# Altium project bhumishboard.PrjPcb (part 2 of 2)

## Sheet SPI.SchDoc
size A3
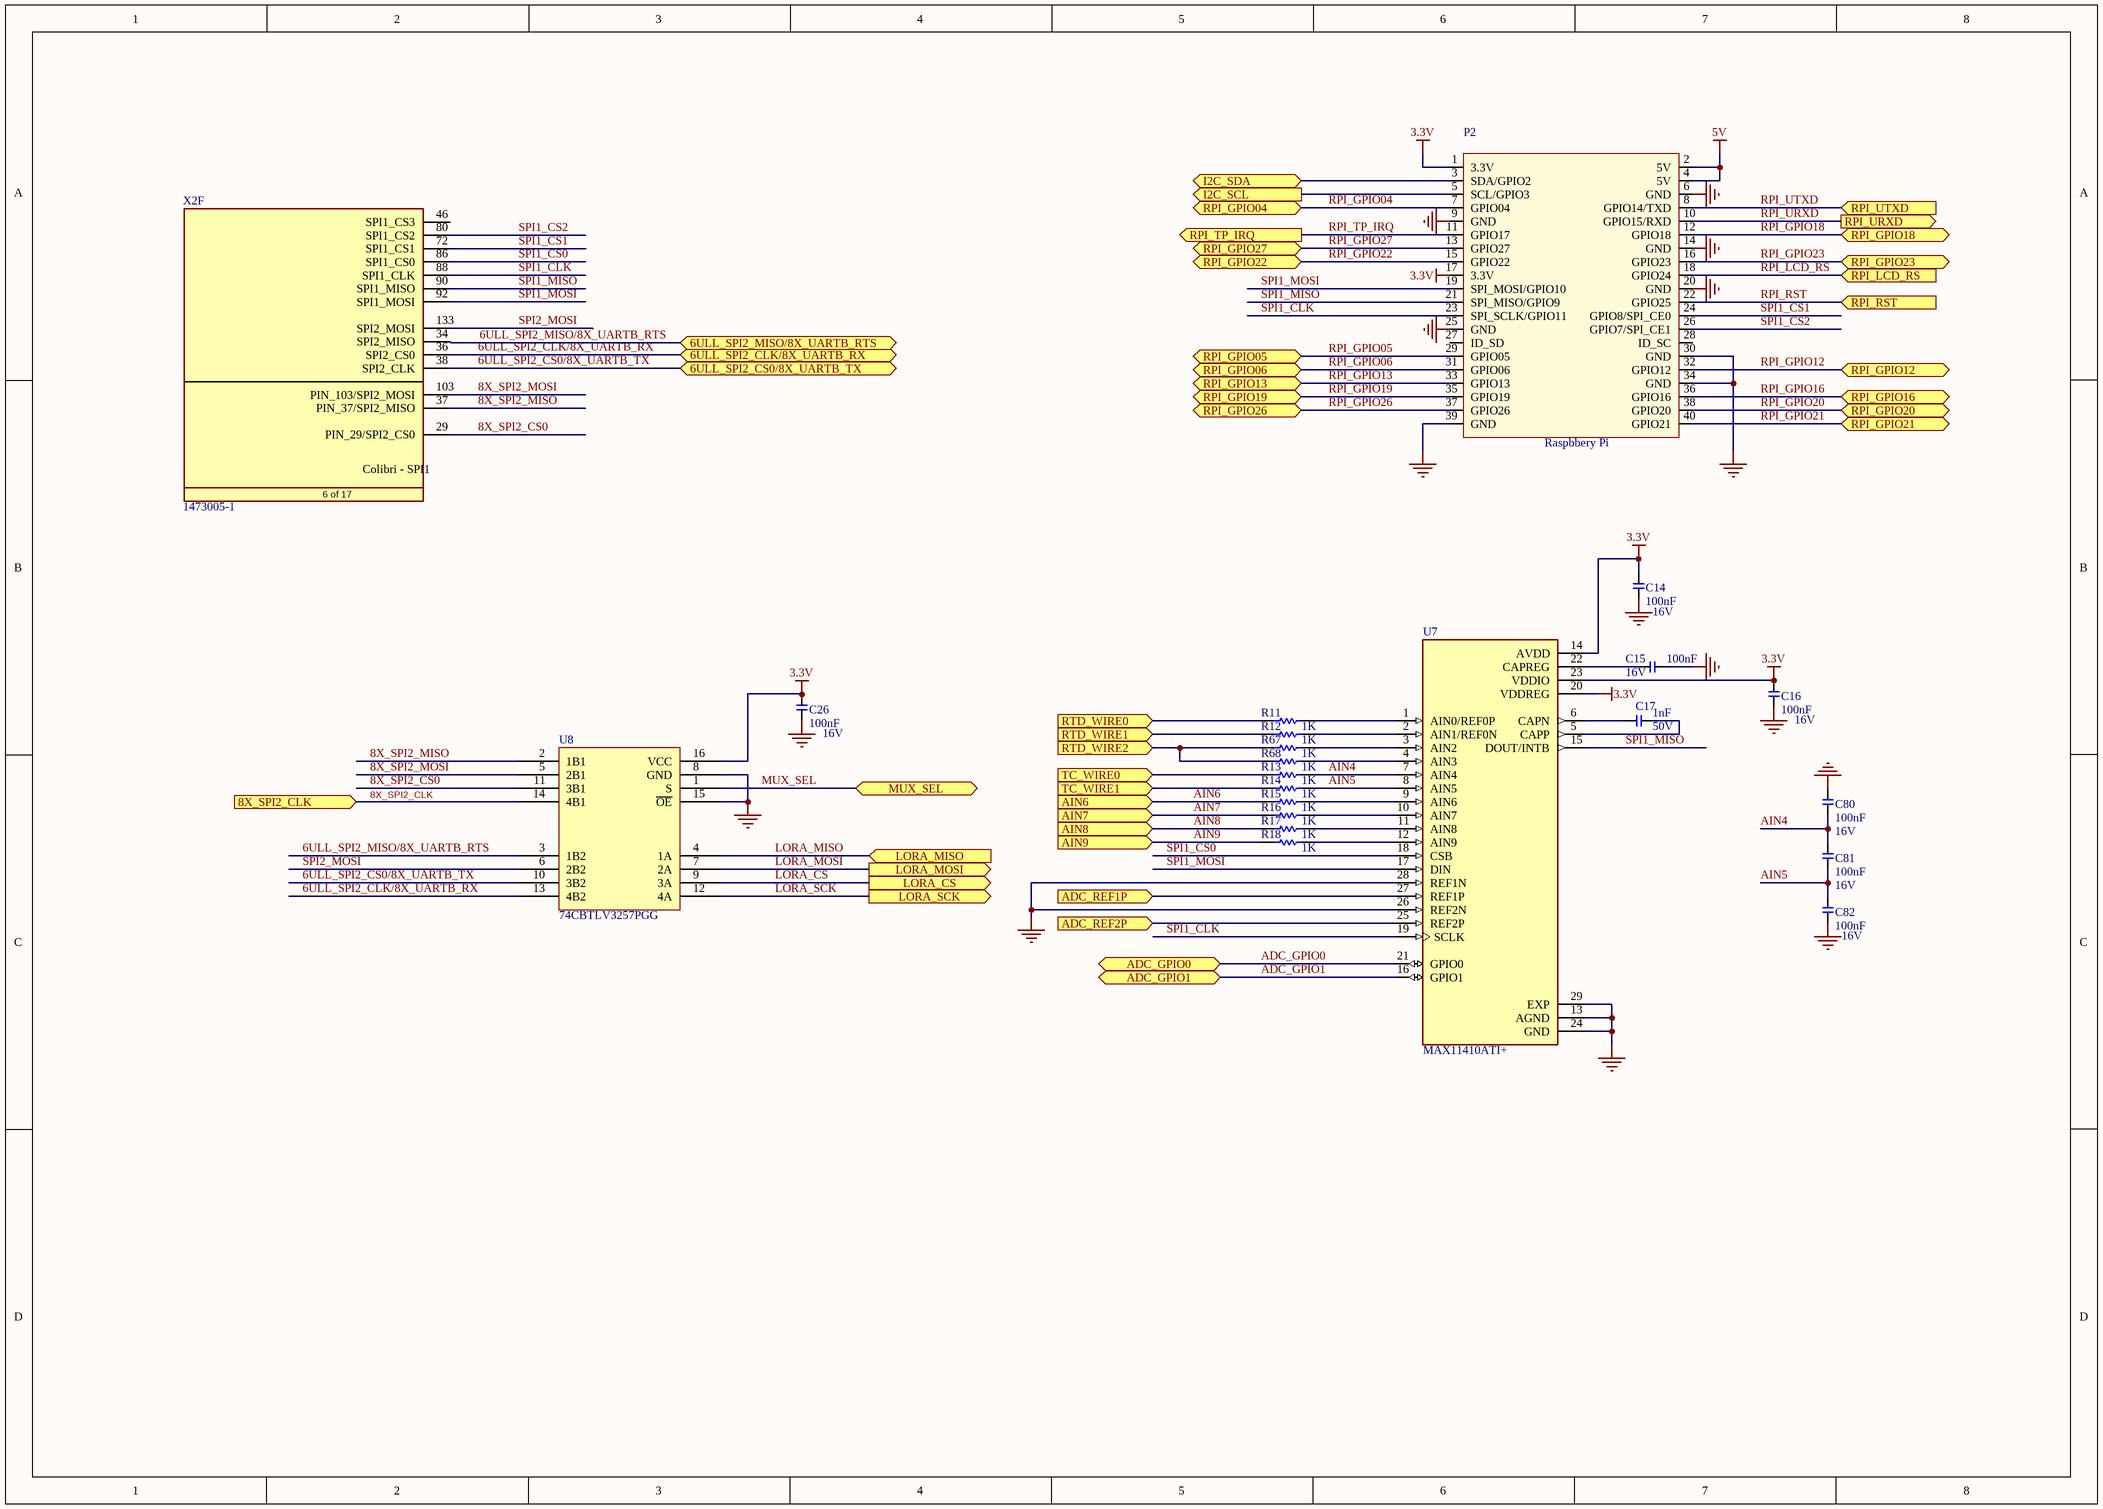
[diagram p10: SPI.SchDoc]

### Parts
C14  Rating: 16V  [T_CAPC0603X33N]  (hidden comment: 100nF)
C15  Rating: 16V  [T_CAPC0603X33N]  (hidden comment: 100nF)
C16  Rating: 16V  [T_CAPC0603X33N]  (hidden comment: 100nF)
C17  Rating: 50V  [CAPC1005X60N]  (hidden comment: 1nF)
C26  Rating: 16V  [T_CAPC0603X33N]  (hidden comment: 100nF)
C80  Rating: 16V  [T_CAPC0603X33N]  (hidden comment: 100nF)
C81  Rating: 16V  [T_CAPC0603X33N]  (hidden comment: 100nF)
C82  Rating: 16V  [T_CAPC0603X33N]  (hidden comment: 100nF)
P2  Raspbbery Pi  [RASPI_GPIO_B+]
R11  1K  [RESC1608X50N]
R12  1K  [RESC1608X50N]
R13  1K  [RESC1608X50N]
R14  1K  [RESC1608X50N]
R15  1K  [RESC1608X50N]
R16  1K  [RESC1608X50N]
R17  1K  [RESC1608X50N]
R18  1K  [RESC1608X50N]
R67  1K  [RESC1608X50N]
R68  1K  [RESC1608X50N]
U7  MAX11410ATI+  [QFN40P400X400X80-29N]
U8  74CBTLV3257PGG  [SOP65P640X120-16N]
X2  1473005-1  [T_Tyco_1473005-1]  (part F of 17)

### Ports
6ULL_SPI2_CLK/8X_UARTB_RX (bidir), 6ULL_SPI2_CS0/8X_UARTB_TX (bidir), 6ULL_SPI2_MISO/8X_UARTB_RTS (bidir), 8X_SPI2_CLK (in), ADC_GPIO0 (bidir), ADC_GPIO1 (bidir), ADC_REF1P (in), ADC_REF2P (in), AIN6 (in), AIN7 (in), AIN8 (in), AIN9 (in), I2C_SCL (out), I2C_SDA (bidir), LORA_CS (out), LORA_MISO (in), LORA_MOSI (out), LORA_SCK (out), MUX_SEL (bidir), RPI_GPIO04 (bidir), RPI_GPIO05 (bidir), RPI_GPIO06 (bidir), RPI_GPIO12 (bidir), RPI_GPIO13 (bidir), RPI_GPIO16 (bidir), RPI_GPIO18 (bidir), RPI_GPIO19 (bidir), RPI_GPIO20 (bidir), RPI_GPIO21 (bidir), RPI_GPIO22 (bidir), RPI_GPIO23 (bidir), RPI_GPIO26 (bidir), RPI_GPIO27 (bidir), RPI_LCD_RS (in), RPI_RST (in), RPI_TP_IRQ (out), RPI_URXD (out), RPI_UTXD (in), RTD_WIRE0 (in), RTD_WIRE1 (in), RTD_WIRE2 (in), TC_WIRE0 (in), TC_WIRE1 (in)

### Nets
3.3V: C14.2 C16.2 C26.2 P2.1(3.3V) P2.17(3.3V) U7.14(AVDD) U7.20(VDDREG) U7.23(VDDIO) U8.16(VCC)
5V: P2.2(5V) P2.4(5V)
GND: C14.1 C15.1 C16.1 C26.1 C80.2 C82.1 P2.6(GND) P2.9(GND) P2.14(GND) P2.20(GND) P2.25(GND) P2.30(GND) P2.34(GND) P2.39(GND) U7.13(AGND) U7.24(GND) U7.26(REF2N) U7.28(REF1N) U7.29(EXP) U8.8(GND) U8.15(~{OE})
6ULL_SPI2_CLK/8X_UARTB_RX: U8.13(4B2) X2.36(SPI2_CS0) ; port 6ULL_SPI2_CLK/8X_UARTB_RX
6ULL_SPI2_CS0/8X_UARTB_TX: U8.10(3B2) X2.38(SPI2_CLK) ; port 6ULL_SPI2_CS0/8X_UARTB_TX
6ULL_SPI2_MISO/8X_UARTB_RTS: U8.3(1B2) X2.34(SPI2_MISO) ; port 6ULL_SPI2_MISO/8X_UARTB_RTS
8X_SPI2_CLK: U8.14(4B1) ; port 8X_SPI2_CLK
8X_SPI2_CS0: U8.11(3B1) X2.29(PIN_29/SPI2_CS0)
8X_SPI2_MISO: U8.2(1B1) X2.37(PIN_37/SPI2_MISO)
8X_SPI2_MOSI: U8.5(2B1) X2.103(PIN_103/SPI2_MOSI)
ADC_GPIO0: U7.21(GPIO0) ; port ADC_GPIO0
ADC_GPIO1: U7.16(GPIO1) ; port ADC_GPIO1
ADC_REF1P: U7.27(REF1P) ; port ADC_REF1P
AIN4: C80.1 C81.2 R13.2 U7.7(AIN4)
AIN5: C81.1 C82.2 R14.2 U7.8(AIN5)
AIN6: R15.1 ; port AIN6
AIN7: R16.1 ; port AIN7
AIN8: R17.1 ; port AIN8
AIN9: R18.1 U7.25(REF2P) ; port AIN9, port ADC_REF2P
I2C_SCL: P2.5(SCL/GPIO3) ; port I2C_SCL
I2C_SDA: P2.3(SDA/GPIO2) ; port I2C_SDA
LORA_CS: U8.9(3A) ; port LORA_CS
LORA_MISO: U8.4(1A) ; port LORA_MISO
LORA_MOSI: U8.7(2A) ; port LORA_MOSI
LORA_SCK: U8.12(4A) ; port LORA_SCK
MUX_SEL: U8.1(S) ; port MUX_SEL
RPI_GPIO04: P2.7(GPIO04) ; port RPI_GPIO04
RPI_GPIO05: P2.29(GPIO05) ; port RPI_GPIO05
RPI_GPIO06: P2.31(GPIO06) ; port RPI_GPIO06
RPI_GPIO12: P2.32(GPIO12) ; port RPI_GPIO12
RPI_GPIO13: P2.33(GPIO13) ; port RPI_GPIO13
RPI_GPIO16: P2.36(GPIO16) ; port RPI_GPIO16
RPI_GPIO18: P2.12(GPIO18) ; port RPI_GPIO18
RPI_GPIO19: P2.35(GPIO19) ; port RPI_GPIO19
RPI_GPIO20: P2.38(GPIO20) ; port RPI_GPIO20
RPI_GPIO21: P2.40(GPIO21) ; port RPI_GPIO21
RPI_GPIO22: P2.15(GPIO22) ; port RPI_GPIO22
RPI_GPIO23: P2.16(GPIO23) ; port RPI_GPIO23
RPI_GPIO26: P2.37(GPIO26) ; port RPI_GPIO26
RPI_GPIO27: P2.13(GPIO27) ; port RPI_GPIO27
RPI_LCD_RS: P2.18(GPIO24) ; port RPI_LCD_RS
RPI_RST: P2.22(GPIO25) ; port RPI_RST
RPI_TP_IRQ: P2.11(GPIO17) ; port RPI_TP_IRQ
RPI_URXD: P2.10(GPIO15/RXD) ; port RPI_URXD
RPI_UTXD: P2.8(GPIO14/TXD) ; port RPI_UTXD
RTD_WIRE0: R11.1 ; port RTD_WIRE0
RTD_WIRE1: R12.1 ; port RTD_WIRE1
RTD_WIRE2: R67.1 R68.1 ; port RTD_WIRE2
SPI1_CLK: P2.23(SPI_SCLK/GPIO11) U7.19(SCLK) X2.88(SPI1_CLK)
SPI1_CS0: U7.18(CSB) X2.86(SPI1_CS0)
SPI1_CS1: P2.24(GPIO8/SPI_CE0) X2.72(SPI1_CS1)
SPI1_CS2: P2.26(GPIO7/SPI_CE1) X2.80(SPI1_CS2)
SPI1_MISO: P2.21(SPI_MISO/GPIO9) U7.15(DOUT/INTB) X2.90(SPI1_MISO)
SPI1_MOSI: P2.19(SPI_MOSI/GPIO10) U7.17(DIN) X2.92(SPI1_MOSI)
SPI2_MOSI: U8.6(2B2) X2.133(SPI2_MOSI)
TC_WIRE0: R13.1 ; port TC_WIRE0
TC_WIRE1: R14.1 ; port TC_WIRE1
NetC15_2: C15.2 U7.22(CAPREG)
NetC17_1: C17.1 U7.5(CAPP)
NetC17_2: C17.2 U7.6(CAPN)
NetR11_2: R11.2 U7.1(AIN0/REF0P)
NetR12_2: R12.2 U7.2(AIN1/REF0N)
NetR15_2: R15.2 U7.9(AIN6)
NetR16_2: R16.2 U7.10(AIN7)
NetR17_2: R17.2 U7.11(AIN8)
NetR18_2: R18.2 U7.12(AIN9)
NetR67_2: R67.2 U7.3(AIN2)
NetR68_2: R68.2 U7.4(AIN3)

Not connected (* = marked no-connect by the designer): P2 27(ID_SD) 28(ID_SC); X2 46(SPI1_CS3)

### Notes on the sheet
- (in symbol CON-Tyco-1473005-1-200-0.6mm, part F) Colibri - SPI1; 6 of 17

### Library data of the parts
C14-C16 C26 C80-C82 = C-X7R-100nF-16V-10%-0603: Capacitor Ceramic X7R 100nF 16V 10% 0603; Tolerance: 10%; Type: X7R; Value: 100nF
C17 = C-X7R-1nF-50V-10%-0402: Capacitor Ceramic X7R 1nF 50V 10% 0402; Tolerance: 10%; Type: X7R; Value: 1nF
P2 = RASPI_GPIO_B+_PIN
R11-R18 R67 R68 = Res1: Resistor; mpn: CRCW060310K0FKEAHP; E14: 1738918; LatestRevisionDate: 17-Jul-2002; LatestRevisionNote: Re-released for DXP Platform.; PackageReference: AXIAL-0.3; PackageDescription: Axial Device, Thru-Hole; 2 Leads; 0.3 in Pin Spacing; Value: 1K
U7 = MAX11410ATI+: 24 Bit Analog to Digital Converter 5, 10 Input 1 Sigma-Delta 28-TQFN _4x4_; MF: Maxim Integrated; Package: TQFN-28 Maxim; MP: MAX11410ATI+; Price: None; Availability: Unavailable; Value: *; SnapEDA_Link: https://www.snapeda.com/parts/MAX11410ATI+/Maxim%20Integrated/view-part/1232119/?ref=snap
X2 = CON-Tyco-1473005-1-200-0.6mm: as X2 on sheet Colibri; Manufacturer Part No.: 1473005-1

## Sheet USB.SchDoc: Iris
size A3; Organization: Toradex AG; Address1: Altsagenstrasse 5; Address2: Horw; Address3: 6048; Address4: Switzerland; DocumentNumber: 6; Revision: V2.0; SheetNumber: 6; SheetTotal: 16
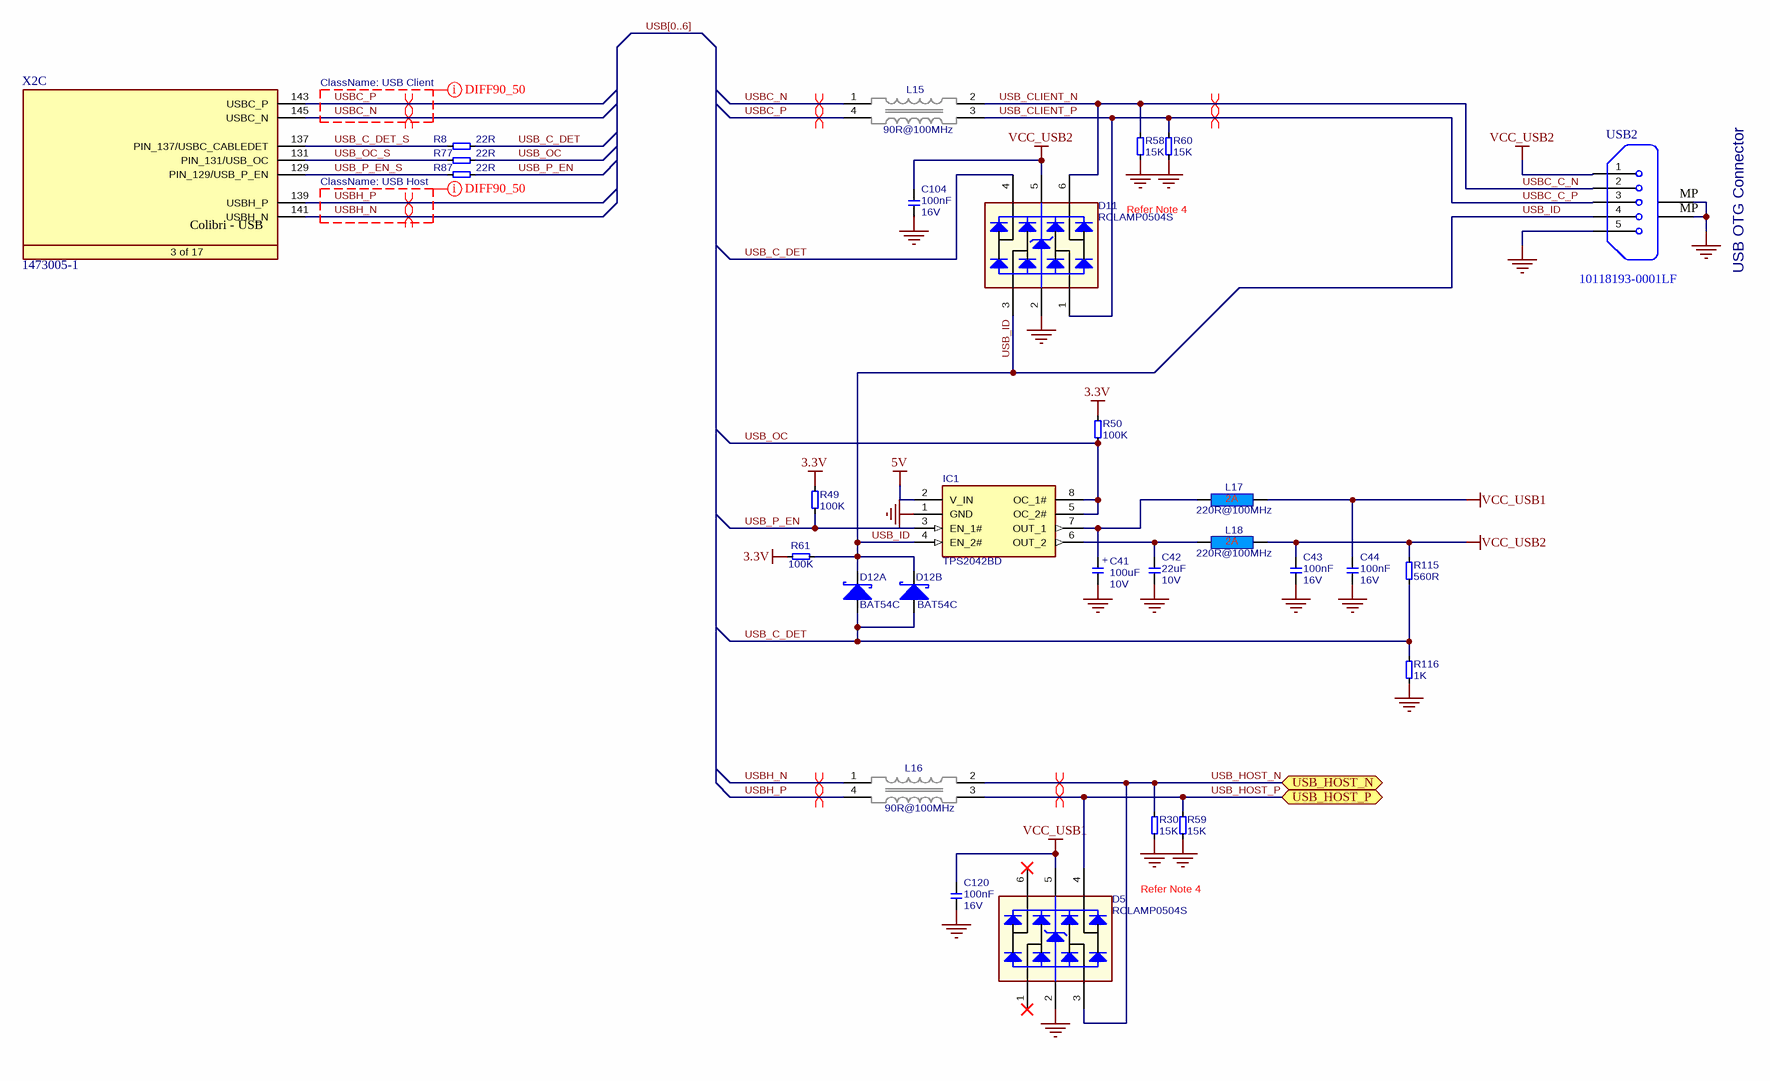
[diagram p11: USB.SchDoc]

### Parts
C41  Rating: 10V  [CAPMP3528X210N]  (hidden comment: 100uF)
C42  Rating: 10V  [T_CAPC0805X125N]  (hidden comment: 22uF)
C43  Rating: 16V  [CAPC1005X60N]  (hidden comment: 100nF)
C44  Rating: 16V  [CAPC1005X60N]  (hidden comment: 100nF)
C104  Rating: 16V  [CAPC1005X60N]  (hidden comment: 100nF)
C120  Rating: 16V  [CAPC1005X60N]  (hidden comment: 100nF)
D5  RCLAMP0504S  [T_SOT95P285X90-6N]
D11  RCLAMP0504S  [T_SOT95P285X90-6N]
D12  BAT54C  [SOT95P230X110-3N]  (parts A,B of 2)
IC1  TPS2042BD  [SOIC127P600X173-8N]
L15  90R@100MHz  [T_Murata_DLW21SN900SQ2]
L16  90R@100MHz  [T_Murata_DLW21SN900SQ2]
L17  220R@100MHz  [INDC1608X95N]
L18  220R@100MHz  [INDC1608X95N]
R8  22R  [RESC1005X40N]
R30  15K  [T_RESC0603X30N]
R49  100K  [RESC1005X40N]
R50  100K  [RESC1005X40N]
R58  15K  [T_RESC0603X30N]
R59  15K  [T_RESC0603X30N]
R60  15K  [T_RESC0603X30N]
R61  100K  [RESC1005X40N]
R77  22R  [RESC1005X40N]
R87  22R  [RESC1005X40N]
R115  560R  [RESC1005X40N]
R116  1K  [RESC1005X40N]
USB2  10118193-0001LF  [10118193-0001LF]
X2  1473005-1  [T_Tyco_1473005-1]  (part C of 17)

### Ports
USB_HOST_N (bidir), USB_HOST_P (bidir)

### Nets
3.3V: R49.2 R50.2 R61.2
5V: IC1.2(V_IN)
GND: C41.2 C42.1 C43.1 C44.1 C104.1 C120.1 D5.2 D11.2 IC1.1(GND) R30.1 R58.1 R59.1 R60.1 R116.2 USB2.5 USB2.6
VCC_USB1: C44.2 C120.2 D5.5 L17.2
VCC_USB2: C43.2 C104.2 D11.5 L18.2 R115.1 USB2.1
USB_C_DET: D11.4 D12.1 D12.2 R8.2 R115.2 R116.1
USB_C_DET_S: R8.1 X2.137(PIN_137/USBC_CABLEDET)
USB_CLIENT_N: D11.6 L15.2 R58.2 USB2.2  [also labelled USBC_C_N]
USB_CLIENT_P: D11.1 L15.3 R60.2 USB2.3  [also labelled USBC_C_P]
USB_HOST_N: D5.3 L16.2 R30.2 ; port USB_HOST_N
USB_HOST_P: D5.4 L16.3 R59.2 ; port USB_HOST_P
USB_ID: D11.3 D12.3 IC1.4(EN_2#) R61.1 USB2.4
USB_OC: IC1.5(OC_2#) IC1.8(OC_1#) R50.1 R77.2
USB_OC_S: R77.1 X2.131(PIN_131/USB_OC)
USB_P_EN: IC1.3(EN_1#) R49.1 R87.2
USB_P_EN_S: R87.1 X2.129(PIN_129/USB_P_EN)
USBC_N: L15.1 X2.145(USBC_N)
USBC_P: L15.4 X2.143(USBC_P)
USBH_N: L16.1 X2.141(USBH_N)
USBH_P: L16.4 X2.139(USBH_P)
NetC41_1: C41.1 IC1.7(OUT_1) L17.1
NetC42_2: C42.2 IC1.6(OUT_2) L18.1

Not connected (* = marked no-connect by the designer): D5 1* 6*

### Buses and harness runs
bus USB[0..6]

### Layout directives
differential pair: USB_CLIENT_N, USB_CLIENT_P, USB_HOST_N, USB_HOST_P, USBC_N, USBC_P, USBH_N, USBH_P
net class USB Client: USBC_N, USBC_P
net class USB Host: USBH_N, USBH_P

### Notes on the sheet
- Refer Note 4
- USB OTG Connector
- Title
- Size:
- Date:
- A3
- Number:
- Time:
- Revision:
- Sheet
- of
- File:
- (in symbol C-TA-100uF-10V-20%-3528) +
- (in symbol CON-Tyco-1473005-1-200-0.6mm, part C) Colibri - USB; 3 of 17
- (in symbol USB Micro-B) MP

### Library data of the parts
C41 = C-TA-100uF-10V-20%-3528: Capacitor TA 100uF 10V 20% 3528; Tolerance: 20%; Type: TA; Value: 100uF
C42 = C-X5R-22uF-10V-20%-0805: Capacitor Ceramic X5R 22uF 10V 20% 0805; Tolerance: 20%; Type: X5R; Value: 22uF
C43 C44 C104 C120 = C-X7R-100nF-16V-10%-0402: Capacitor Ceramic X7R 100nF 16V 10% 0402; Tolerance: 10%; Type: X7R; Value: 100nF
D5 D11 = D-Semtech-RClamp0504S: TVS Array low cap; Manufacturer Name: Semtech; Manufacturer Part No.: RCLAMP0504S
D12 = D-Philips-BAT54C-Schottky: BAT54C Schottky Diode; Manufacturer Name: Philips; Manufacturer Part No.: BAT54C
IC1 = IC-TI-TPS2042BD: Dual High Side Switch With OC_DET 500mA/CH; Manufacturer Name: Texas Instruments; Manufacturer Part No.: TPS2042BD
L15 L16 = L-Murata-DLW21SN900SQ2-90R@100MHz-330mA-25%: Common Mode Choke High Speed 90R 330mA; Manufacturer Name: Murata; Tolerance: 25%; Rating: 330mA; Manufacturer Part No.: DLW21SN900SQ2; Value: 90R@100MHz
L17 L18 = L-220R@100MHz-2A-25%-0603: 220R@100MHz 2A EMI FILTER; Tolerance: 25%; Rating: 2A; Value: 220R@100MHz
R8 R77 R87 = R-22R-63mW-5%-0402: Resistor 22 ohm 63mW 5% 0402; Rating: 63mW; Tolerance: 5%; Value: 22R
R30 R58-R60 = R-15KR-63mW-5%-0603: Resistor 15 Kohm 63mW 5% 0603; Value: 15KR; Rating: 63mW; Tolerance: 5%
R49 R50 R61 = R-100KR-63mW-5%-0402: Resistor 100 Kohm 63mW 5% 0402; Value: 100KR; Rating: 63mW; Tolerance: 5%
R115 = R-560R-63mW-5%-0402: Resistor 560 ohm 63mW 5% 0402; Rating: 63mW; Tolerance: 5%; Value: 560R
R116 = R-1KR-63mW-5%-0402: Resistor 1 Kohm 63mW 5% 0402; Rating: 63mW; Tolerance: 5%; Value: 1K
USB2 = USB Micro-B: Value: Micro USB Type B; E14 pn: 2751675; mpn: 10118193-0001LF
X2 = CON-Tyco-1473005-1-200-0.6mm: SODIMM Connector; Manufacturer Name: Tyco; No. of ways: 200; Manufacturer Part No.: 1473005-1

## Sheet Zigbee.SchDoc
size A3
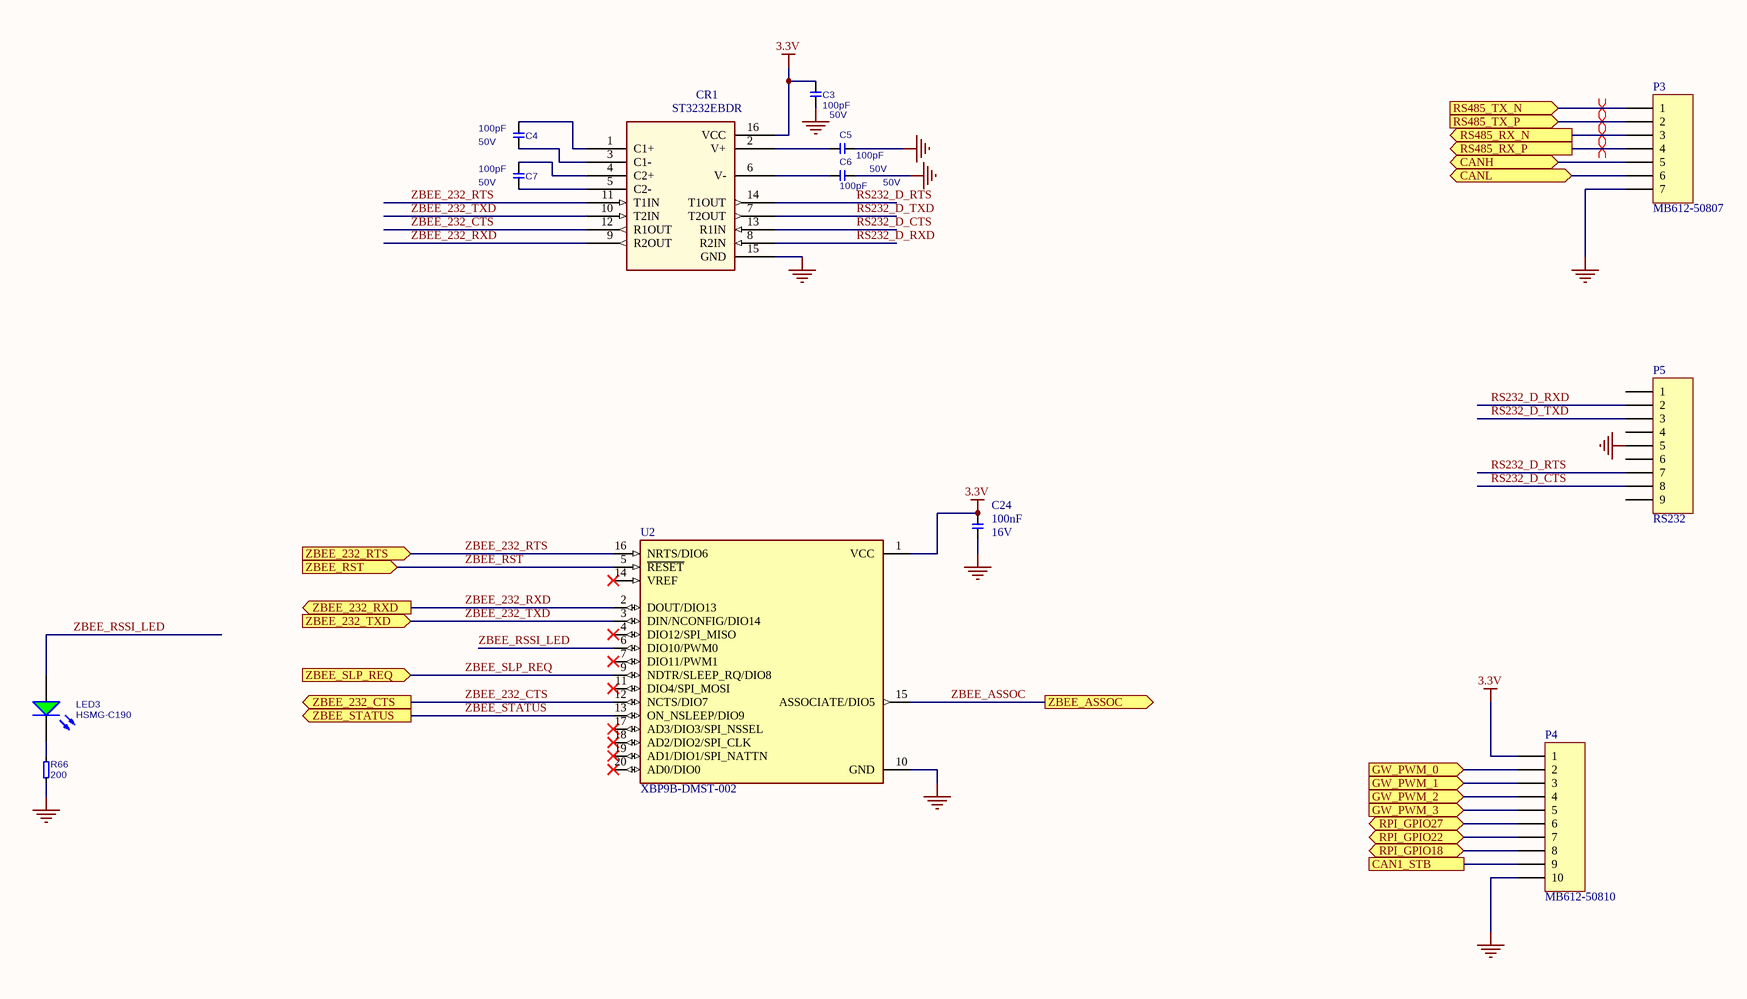
[diagram p12: Zigbee.SchDoc]

### Parts
C3  Rating: 50V  [CAPC1005X60N]  (hidden comment: 100pF)
C4  Rating: 50V  [CAPC1005X60N]  (hidden comment: 100pF)
C5  Rating: 50V  [CAPC1005X60N]  (hidden comment: 100pF)
C6  Rating: 50V  [CAPC1005X60N]  (hidden comment: 100pF)
C7  Rating: 50V  [CAPC1005X60N]  (hidden comment: 100pF)
C24  Rating: 16V  [T_CAPC0603X33N]  (hidden comment: 100nF)
CR1  ST3232EBDR  [SO-16_STM]
LED3  Manufacturer Part No.: HSMG-C190  [LEDC1608X80N]  (hidden comment: LED)
P3  MB612-50807  [MB612-50807]
P4  MB612-50810  [1729186 5.08 - 10pos]
P5  RS232  [2301843-1]
R66  200  [RESC1005X40N]
U2  XBP9B-DMST-002  [DIP2200W51P200L3294H279Q20P]

### Ports
CAN1_STB, CANH (bidir), CANL (bidir), GW_PWM_0 (in), GW_PWM_1 (in), GW_PWM_2 (in), GW_PWM_3 (in), RPI_GPIO18 (bidir), RPI_GPIO22 (bidir), RPI_GPIO27 (bidir), RS485_RX_N (out), RS485_RX_P (out), RS485_TX_N (in), RS485_TX_P (in), ZBEE_232_CTS (out), ZBEE_232_RTS (in), ZBEE_232_RXD (out), ZBEE_232_TXD (in), ZBEE_ASSOC (out), ZBEE_RST (in), ZBEE_SLP_REQ (in), ZBEE_STATUS (out)

### Nets
3.3V: C3.1 C24.2 CR1.16(VCC) P4.1 U2.1(VCC)
GND: C3.2 C5.1 C6.1 C24.1 CR1.15(GND) P3.7 P4.10 P5.5 R66.2 U2.10(GND)
CAN1_STB: P4.9 ; port CAN1_STB
CANH: P3.5 ; port CANH
CANL: P3.6 ; port CANL
GW_PWM_0: P4.2 ; port GW_PWM_0
GW_PWM_1: P4.3 ; port GW_PWM_1
GW_PWM_2: P4.4 ; port GW_PWM_2
GW_PWM_3: P4.5 ; port GW_PWM_3
RPI_GPIO18: P4.8 ; port RPI_GPIO18
RPI_GPIO22: P4.7 ; port RPI_GPIO22
RPI_GPIO27: P4.6 ; port RPI_GPIO27
RS232_D_CTS: CR1.13(R1IN) P5.8
RS232_D_RTS: CR1.14(T1OUT) P5.7
RS232_D_RXD: CR1.8(R2IN) P5.2
RS232_D_TXD: CR1.7(T2OUT) P5.3
RS485_RX_N: P3.3 ; port RS485_RX_N
RS485_RX_P: P3.4 ; port RS485_RX_P
RS485_TX_N: P3.1 ; port RS485_TX_N
RS485_TX_P: P3.2 ; port RS485_TX_P
ZBEE_232_CTS: CR1.12(R1OUT) U2.12(NCTS/DIO7) ; port ZBEE_232_CTS
ZBEE_232_RTS: CR1.11(T1IN) U2.16(NRTS/DIO6) ; port ZBEE_232_RTS
ZBEE_232_RXD: CR1.9(R2OUT) U2.2(DOUT/DIO13) ; port ZBEE_232_RXD
ZBEE_232_TXD: CR1.10(T2IN) U2.3(DIN/NCONFIG/DIO14) ; port ZBEE_232_TXD
ZBEE_ASSOC: U2.15(ASSOCIATE/DIO5) ; port ZBEE_ASSOC
ZBEE_RSSI_LED: LED3.2(A) U2.6(DIO10/PWM0)
ZBEE_RST: U2.5(~{RESET}) ; port ZBEE_RST
ZBEE_SLP_REQ: U2.9(NDTR/SLEEP_RQ/DIO8) ; port ZBEE_SLP_REQ
ZBEE_STATUS: U2.13(ON_NSLEEP/DIO9) ; port ZBEE_STATUS
NetC4_1: C4.1 CR1.3(C1-)
NetC4_2: C4.2 CR1.1(C1+)
NetC5_2: C5.2 CR1.2(V+)
NetC6_2: C6.2 CR1.6(V-)
NetC7_1: C7.1 CR1.5(C2-)
NetC7_2: C7.2 CR1.4(C2+)
NetLED3_1: LED3.1(K) R66.1

Not connected (* = marked no-connect by the designer): P5 1 4 6 9; U2 4(DIO12/SPI_MISO)* 7(DIO11/PWM1)* 11(DIO4/SPI_MOSI)* 14(VREF)* 17(AD3/DIO3/SPI_NSSEL)* 18(AD2/DIO2/SPI_CLK)* 19(AD1/DIO1/SPI_NATTN)* 20(AD0/DIO0)*

### Layout directives
differential pair: RS485_RX_N, RS485_RX_P, RS485_TX_N, RS485_TX_P

### Library data of the parts
C3-C7 = C-X7R-100pF-50V-10%-0402: Capacitor Ceramic X7R 100pF 50V 10% 0402; Tolerance: 10%; Type: X7R; Value: 100pF
C24 = C-X7R-100nF-16V-10%-0603: Capacitor Ceramic X7R 100nF 16V 10% 0603; Tolerance: 10%; Type: X7R; Value: 100nF
CR1 = ST3232EBDR: SourceLibrary: StMicro_2011-06-07; Built_By: EMA_UL_Team; Vendor: STMicroelectronics; Value: ST3232EBDR; Manufacturer_Part_Number: ST3232EBDR
LED3 = LED-Avago-HSMG-C190: Surface mount LED green 20mA; Manufacturer Name: Avago
P3 = Header 7: Header, 7-Pin; LatestRevisionDate: 17-Jul-2002; LatestRevisionNote: Re-released for DXP Platform.; Publisher: Altium Limited
P4 = Header 10: Header, 10-Pin; LatestRevisionDate: 17-Jul-2002; LatestRevisionNote: Re-released for DXP Platform.; Publisher: Altium Limited
P5 = Header 9: 2301843-1; LatestRevisionDate: 17-Jul-2002; LatestRevisionNote: Re-released for DXP Platform.; Publisher: Altium Limited
R66 = R-1KR-63mW-5%-0402: Resistor 1 Kohm 63mW 5% 0402; Value: 1K; Rating: 63mW; Tolerance: 5%
U2 = XBP9B-DMST-002: General ISM < 1GHz Transceiver Module 900MHz Antenna Not Included, RP-SMA Through Hole; MF: Digi International; Price: None; Availability: Unavailable; SnapEDA_Link: https://www.snapeda.com/parts/XBP9B-DMST-002/Digi%20International/view-part/1127866/?ref=snap; MP: XBP9B-DMST-002; Value: *; Package: Module Digiboard

## Sheet Ethernet.SchDoc: Ethernet
size A3; DocumentNumber: 5; Revision: V2.0; SheetNumber: 5; SheetTotal: 16
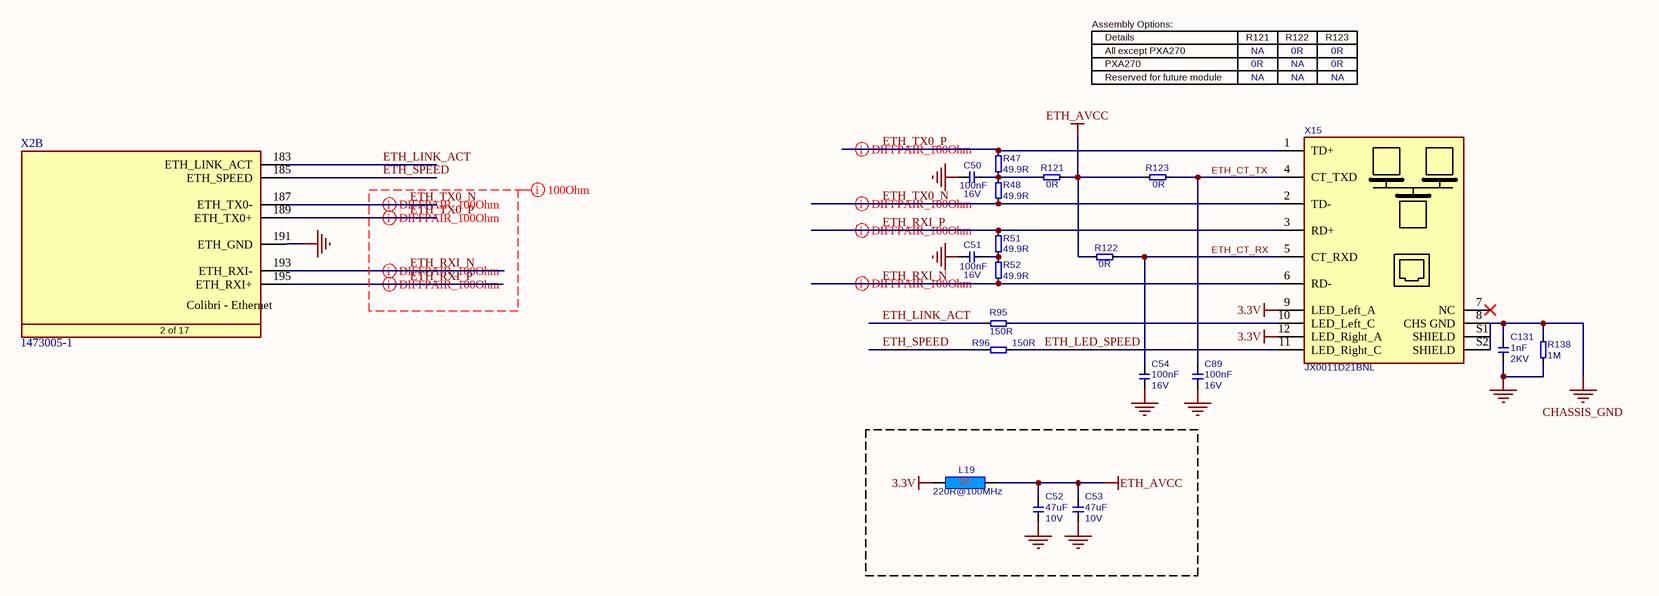
[diagram p13: Ethernet.SchDoc]

### Parts
C50  Rating: 16V  [CAPC1005X60N]  (hidden comment: 100nF)
C51  Rating: 16V  [CAPC1005X60N]  (hidden comment: 100nF)
C52  Rating: 10V  [T_CAPC0805X125N]  (hidden comment: 47uF)
C53  Rating: 10V  [T_CAPC0805X125N]  (hidden comment: 47uF)
C54  Rating: 16V  [CAPC1005X60N]  (hidden comment: 100nF)
C89  Rating: 16V  [CAPC1005X60N]  (hidden comment: 100nF)
C131  Rating: 2KV  [T_CAPC1206X180N]  (hidden comment: 1nF)
L19  220R@100MHz  [INDC1608X95N]
R47  49.9R  [RESC1005X40N]
R48  49.9R  [RESC1005X40N]
R51  49.9R  [RESC1005X40N]
R52  49.9R  [RESC1005X40N]
R95  150R  [RESC1005X40N]
R96  150R  [RESC1005X40N]
R121  0R  [T_RESC0603X30N]
R122  0R  [T_RESC0603X30N]
R123  0R  [T_RESC0603X30N]
R138  1M  [T_RESC0603X30N]
X2  1473005-1  [T_Tyco_1473005-1]  (part B of 17)
X15  JX0011D21BNL  [T_Pulse_J00-0065NL]

### Nets
3.3V: L19.1 X15.9(LED_Left_A) X15.12(LED_Right_A)
CHASSIS_GND: C131.2 R138.2 X15.8(CHS_GND) X15.S1(SHIELD) X15.S2(SHIELD)
ETH_AVCC: C52.1 C53.1 L19.2 R121.2 R122.1 R123.1
GND: C50.1 C51.1 C52.2 C53.2 C54.1 C89.1 C131.1 R138.1 X2.191(ETH_GND)
ETH_CT_RX: C54.2 R122.2 X15.5(CT_RXD)
ETH_CT_TX: C89.2 R123.2 X15.4(CT_TXD)
ETH_LED_SPEED: R96.2 X15.11(LED_Right_C)
ETH_LINK_ACT: R95.2 X2.183(ETH_LINK_ACT)
ETH_RXI_N: R52.1 X2.193(ETH_RXI-) X15.6(RD-)
ETH_RXI_P: R51.2 X2.195(ETH_RXI+) X15.3(RD+)
ETH_SPEED: R96.1 X2.185(ETH_SPEED)
ETH_TX0_N: R48.1 X2.187(ETH_TX0-) X15.2(TD-)
ETH_TX0_P: R47.2 X2.189(ETH_TX0+) X15.1(TD+)
NetC50_2: C50.2 R47.1 R48.2 R121.1
NetC51_2: C51.2 R51.1 R52.2
NetR95_1: R95.1 X15.10(LED_Left_C)

Not connected (* = marked no-connect by the designer): X15 7(NC)*

### Layout directives
differential pair: ETH_RXI_N, ETH_RXI_P, ETH_TX0_N, ETH_TX0_P
net class 100Ohm: ETH_RXI_N, ETH_RXI_P, ETH_TX0_N, ETH_TX0_P

### Notes on the sheet
- Assembly Options:
- Details
- R121
- R122
- R123
- All except PXA270
- PXA270
- Reserved for future module
- NA
- 0R
- Title
- Size:
- Date:
- A3
- Number:
- Time:
- Revision:
- Sheet
- of
- File:
- (in symbol CON-Tyco-1473005-1-200-0.6mm, part B) Colibri - Ethernet; 2 of 17

### Library data of the parts
C50 C51 C54 C89 = C-X7R-100nF-16V-10%-0402: Capacitor Ceramic X7R 100nF 16V 10% 0402; Tolerance: 10%; Type: X7R; Value: 100nF
C52 C53 = C-X5R-47uF-10V-20%-0805: Capacitor Ceramic X5R 47uF 10V 20% 0805; Tolerance: 20%; Type: X5R; Value: 47uF
C131 = C-X7R-1nF-2KV-10%-1206: Capacitor Ceramic X7R 1nF 2KV 10% 1206; Tolerance: 10%; Type: X7R; Value: 1nF
L19 = L-220R@100MHz-2A-25%-0603: as L17 on sheet USB; Rating: 2A; Value: 220R@100MHz
R47 R48 R51 R52 = R-49.9R-100mW-1%-0402: Resistor 49.9 ohm 100mW 1% 0402; Rating: 100mW; Tolerance: 1%; Value: 49.9R; Size: 0402
R95 R96 = R-150R-63mW-5%-0402: Resistor 150 ohm 63mW 5% 0402; Tolerance: 5%; Value: 150R; Rating: 63mW
R121-R123 = R-0R-63mW-5%-0603: Resistor 0 ohm 63mW 5% 0603; Rating: 63mW; Tolerance: 5%; Value: 0R; Size: 0603 (In)
R138 = R-1MR-63mW-5%-0603: Resistor 1 Mohm 63mW 5% 0603; Value: 1MR; Rating: 63mW; Tolerance: 5%
X2 = CON-Tyco-1473005-1-200-0.6mm: as X2 on sheet USB; Manufacturer Part No.: 1473005-1
X15 = CON-Pulse-JX0011D21BNL: RJ45 connector with magentics, 10/100 Base-TX, AutoMDIX, Through Hole; Manufacturer Name: Pulse; No. of ways: 12; Manufacturer Part No.: JX0011D21BNL

## Sheet RTC.SchDoc: RTC
size A3; DocumentNumber: 8; Revision: V2.0; SheetNumber: 8; SheetTotal: 16
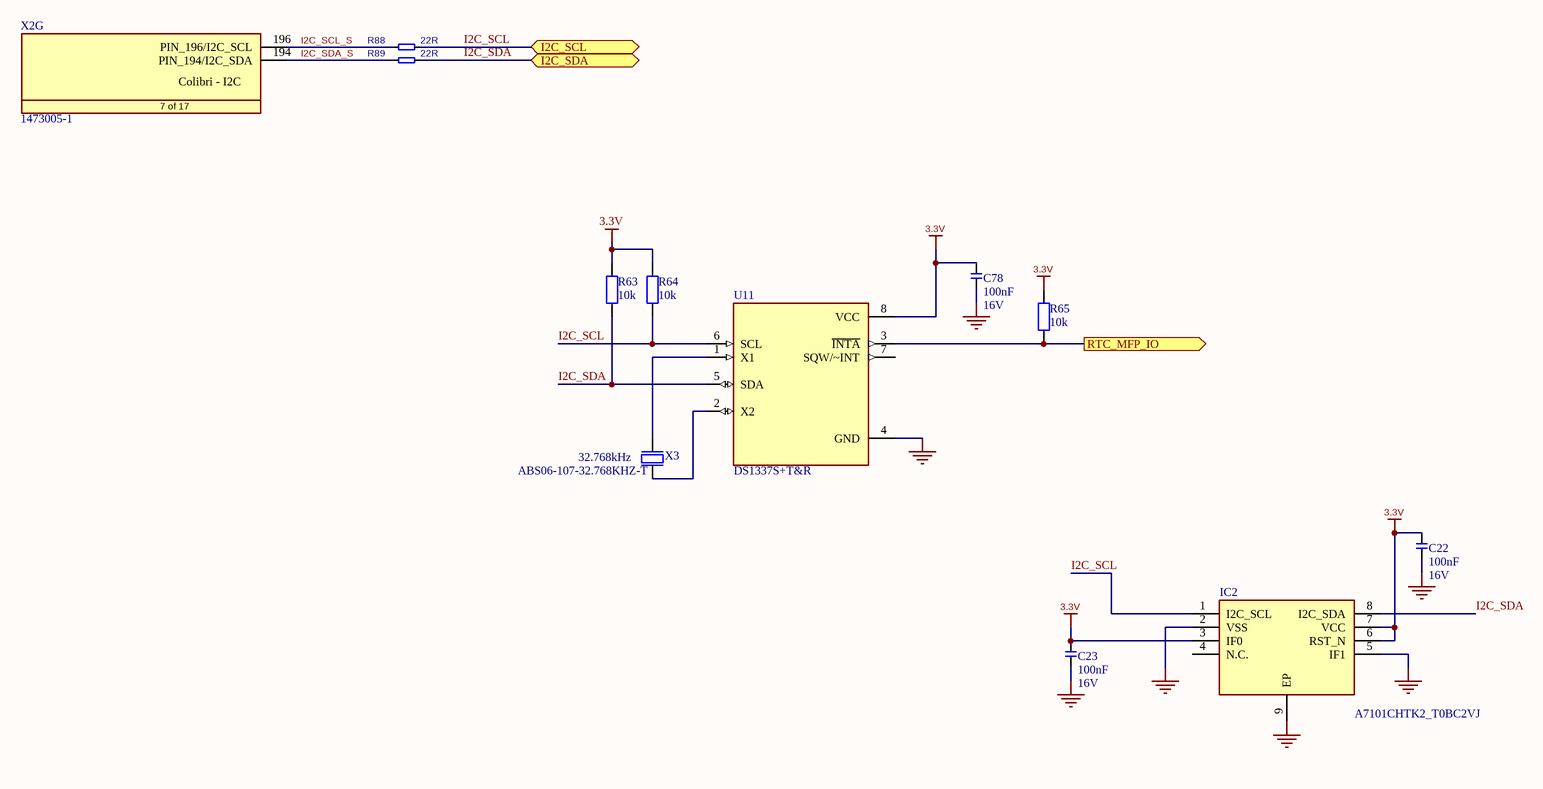
[diagram p14: RTC.SchDoc]

### Parts
C22  Rating: 16V  [T_CAPC0603X33N]  (hidden comment: 100nF)
C23  Rating: 16V  [T_CAPC0603X33N]  (hidden comment: 100nF)
C78  Rating: 16V  [T_CAPC0603X33N]  (hidden comment: 100nF)
IC2  A7101CHTK2_T0BC2VJ  [SON80P400X400X100-9N-D]
R63  10k  [RESC1608X50N]
R64  10k  [RESC1608X50N]
R65  10k  [RESC1608X50N]
R88  22R  [RESC1005X40N]
R89  22R  [RESC1005X40N]
U11  DS1337S+T&R  [SOIC127P600X175-8N]
X2  1473005-1  [T_Tyco_1473005-1]  (part G of 17)
X3  32.768kHz  Manufacturer PN: ABS06-107-32.768KHZ-T  [ABS06]

### Ports
I2C_SCL (bidir), I2C_SDA (bidir), RTC_MFP_IO (out)

### Nets
3.3V: C22.2 C23.2 C78.2 IC2.3(IF0) IC2.6(RST_N) IC2.7(VCC) R63.2 R64.2 R65.2 U11.8(VCC)
GND: C22.1 C23.1 C78.1 IC2.2(VSS) IC2.5(IF1) IC2.9(EP) U11.4(GND)
I2C_SCL: IC2.1(I2C_SCL) R64.1 R88.2 U11.6(SCL) ; port I2C_SCL
I2C_SCL_S: R88.1 X2.196(PIN_196/I2C_SCL)
I2C_SDA: IC2.8(I2C_SDA) R63.1 R89.2 U11.5(SDA) ; port I2C_SDA
I2C_SDA_S: R89.1 X2.194(PIN_194/I2C_SDA)
RTC_MFP_IO: R65.1 U11.3(~{INTA}) ; port RTC_MFP_IO
NetU11_1: U11.1(X1) X3.1(inp)
NetU11_2: U11.2(X2) X3.2(out)

Not connected (* = marked no-connect by the designer): IC2 4(N.C.); U11 7(SQW/~INT)

### Notes on the sheet
- Title
- Size:
- Date:
- A3
- Number:
- Time:
- Revision:
- Sheet
- of
- File:
- (in symbol CON-Tyco-1473005-1-200-0.6mm, part G) Colibri - I2C; 7 of 17

### Library data of the parts
C22 C23 C78 = C-X7R-100nF-16V-10%-0603: Capacitor Ceramic X7R 100nF 16V 10% 0603; Tolerance: 10%; Type: X7R; Value: 100nF
IC2 = A7101CHTK2_T0BC2VJ: Integrated Circuit; Manufacturer_Name: NXP; Manufacturer_Part_Number: A7101CHTK2/T0BC2VJ; Datasheet Link: https://componentsearchengine.com//A7101CHTK2_T0BC2VJ.pdf; Height: 1mm; Mouser2 Part Number: 771-A7101CHTKT0BC2VJ; Mouser2 Price/Stock: https://www.mouser.com/Search/Refine.aspx?Keyword=771-A7101CHTKT0BC2VJ
R63-R65 = CMP-1909346-3: RES SMD 10K OHM 1% 1/8W 0805; Voltage Rating (DC): 150.0 V; Power Rating: 0.125 W; Lead-Free Status: Contains Lead; Resistance: 10000.0 ╬®; Resistance Tolerance: ┬▒1%; Temperature Coefficient: 100.0 ppm/┬░C; Case/Package (SI): 2012; RoHS: Non-Compliant; Case/Package: 0805; Size-Width: 0.00125 m; Power Dissipation: 0.125 W; REACH SVHC Compliance: No SVHC; Size-Length: 0.002 m; Size-Height: 0.00045 m; Mounting Style: Surface Mount; Number of Pins: 2; Octopart Url: http://octopart.com/crcw080510k0fkta-vishay-46587010; OctopartID: 1d05d6c9e4e1c2c2
R88 R89 = R-22R-63mW-5%-0402: Resistor 22 ohm 63mW 5% 0402; Rating: 63mW; Tolerance: 5%; Value: 22R
U11 = DS1337S+T&R: Real Time Clock (RTC) IC Clock/Calendar IÂ²C, 2-Wire Serial 8-SOIC (0.154, 3.90mm Width); MP: DS1337S+T&amp;R; MF: Maxim Integrated; Value: *; Package: SOIC-8 Maxim; Purchase-URL: https://pricing.snapeda.com/search/part/DS1337S+T&amp;R/?ref=eda; SnapEDA_Link: https://www.snapeda.com/parts/DS1337S+T&R/Maxim%20Integrated/view-part/386900/?ref=snap; Digi-Key_Part_Number: DS1337S+T&RCT-ND; Check_prices: https://www.snapeda.com/parts/DS1337S+T&R/Maxim%20Integrated/view-part/386900/?ref=eda
X2 = CON-Tyco-1473005-1-200-0.6mm: as X2 on sheet USB; Manufacturer Part No.: 1473005-1
X3 = XTAL_SMD2016_32MHz_8pF_Epson: XTAL SMD 2016, 32MHz, Cl=8pF, Tol: ±10ppm, Stab: ±10ppm; Part Number: XTAL_SMD2016_32MHz_12pF; Manufacturer: AVX Corp/Kyocera Corp; Note: XTAL SMD 32.000MHz; Artikkelnr Noca: 22019238; Artikkelnr Simpro: N.A.; Datasheet: http://www.epsondevice.com/docs/qd/en/DownloadServlet?id=ID000449; LatestRevisionDate: 2014-11-27; Pin Count: 4; Publisher: Nordic Semiconductor; Published: 2012-03-09; Value: 32.768kHz; Supplier: Farnell; Supplier part number: 171-2806; 2nd source Supplier: *; 2nd source part number: *; Footprint Doc: XTAL_1612

## Sheet DebugConsole.SchDoc
size A4
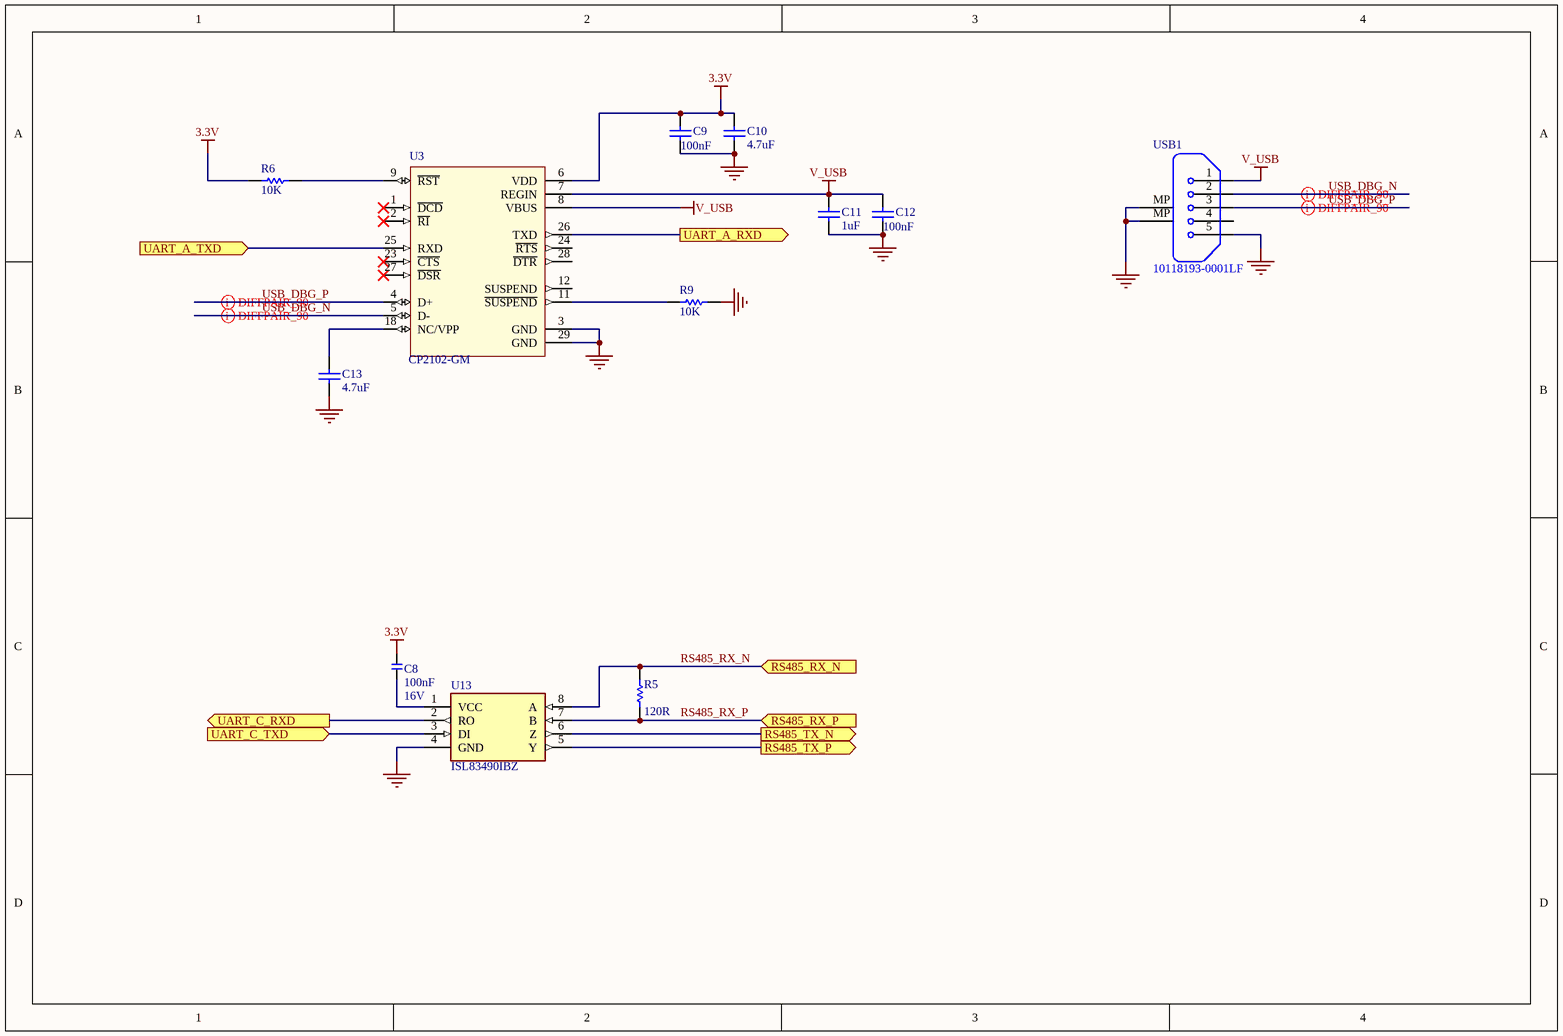
[diagram p15: DebugConsole.SchDoc]

### Parts
C8  Rating: 16V  [T_CAPC0603X33N]  (hidden comment: 100nF)
C9  100nF  [CAPC1608X06L]
C10  4.7uF  [CAPC1608X100N]
C11  1uF  [CAPC1608X100N]
C12  100nF  [CAPC1608X06L]
C13  4.7uF  [CAPC1608X100N]
R5  120R  [T_RESC0603X30N]
R6  10K  [RESC1608X50N]
R9  10K  [RESC1608X50N]
U3  CP2102-GM  [QFN50P500X500X100-29N]
U13  ISL83490IBZ  [SOIC127P600X175-8N]
USB1  10118193-0001LF  [10118193-0001LF]

### Ports
RS485_RX_N (in), RS485_RX_P (in), RS485_TX_N (out), RS485_TX_P (out), UART_A_RXD (out), UART_A_TXD (in), UART_C_RXD (out), UART_C_TXD (in)

### Nets
3.3V: C8.2 C9.1 C10.1 R6.1 U3.6(VDD)
GND: C9.2 C10.2 C11.2 C12.2 C13.2 R9.2 U3.3(GND) U3.29(GND) U13.4(GND) USB1.5 USB1.6
V_USB: C11.1 C12.1 U3.7(REGIN) U3.8(VBUS) USB1.1
RS485_RX_N: R5.2 U13.8(A) ; port RS485_RX_N
RS485_RX_P: R5.1 U13.7(B) ; port RS485_RX_P
RS485_TX_N: U13.6(Z) ; port RS485_TX_N
RS485_TX_P: U13.5(Y) ; port RS485_TX_P
UART_A_RXD: U3.26(TXD) ; port UART_A_RXD
UART_A_TXD: U3.25(RXD) ; port UART_A_TXD
UART_C_RXD: U13.2(RO) ; port UART_C_RXD
UART_C_TXD: U13.3(DI) ; port UART_C_TXD
USB_DBG_N: U3.5(D-) USB1.2
USB_DBG_P: U3.4(D+) USB1.3
NetC8_1: C8.1 U13.1(VCC)
NetC13_1: C13.1 U3.18(NC/VPP)
NetR6_2: R6.2 U3.9(~{RST})
NetR9_1: R9.1 U3.11(~{SUSPEND})

Not connected (* = marked no-connect by the designer): U3 1(~{DCD})* 2(~{RI})* 12(SUSPEND) 23(~{CTS})* 24(~{RTS}) 27(~{DSR})* 28(~{DTR}); USB1 4

### Layout directives
differential pair: USB_DBG_N, USB_DBG_P

### Notes on the sheet
- (in symbol USB Micro-B) MP

### Library data of the parts
C8 = C-X7R-100nF-16V-10%-0603: Capacitor Ceramic X7R 100nF 16V 10% 0603; Tolerance: 10%; Type: X7R; Value: 100nF
C9 C12 = Cap: Capacitor; mpn: MC0603B104K250CT; E14 pn: 2310560; LatestRevisionNote: Re-released for DXP Platform.; PackageReference: RAD-0.3; Publisher: Altium Limited; PackageDescription: Radial Cap, Thru-Hole; 2 Leads; 0.3 in Pin Spacing; Value: 100nF
C10 C13 = CAP: mpn: C0603C475K9PACTU; E14 pn: 9227784; Value: 4.7uF
C11 = CAP: mpn: C0603C105K8PACTU; E14 pn: 9227776; Value: 1uF
R5 = Res1: Resistor; Published: 8-Jun-2000; LatestRevisionDate: 17-Jul-2002; LatestRevisionNote: Re-released for DXP Platform.; PackageReference: AXIAL-0.3; Publisher: Altium Limited; PackageDescription: Axial Device, Thru-Hole; 2 Leads; 0.3 in Pin Spacing; Value: 120R
R6 R9 = Res1: Resistor; mpn: CRCW060310K0FKEAHP; E14: 1738918; LatestRevisionDate: 17-Jul-2002; LatestRevisionNote: Re-released for DXP Platform.; PackageReference: AXIAL-0.3; PackageDescription: Axial Device, Thru-Hole; 2 Leads; 0.3 in Pin Spacing; Value: 10K
U3 = CP2102-GM: USB Bridge, USB to UART USB 2.0 UART Interface 28-QFN (5x5); E14 pn: 9282130; MF: Silicon Labs; Package: QFN-28 Silicon Labs; mpn: CP2102-GM; SnapEDA_Link: https://www.snapeda.com/parts/CP2102-GM/Silicon%20Labs/view-part/135876/?ref=snap; Value: *
U13 = ISL83490IBZ: 1/1 Transceiver Full RS422, RS485 8-SOIC; MF: Renesas / Intersil; Value: *; Digi-Key_Part_Number: ISL83490IBZ-TTR-ND; Package: SOIC-8 Renesas / Intersil; SnapEDA_Link: https://www.snapeda.com/parts/ISL83490IBZ/Intersil/view-part/4709839/?ref=snap; Digi-Key_Purchase_URL: https://www.digikey.com/product-detail/en/renesas-electronics-america-inc/ISL83490IBZ-T/ISL83490IBZ-TTR-ND/1065061?utm_source=snapeda&utm_medium=aggregator&utm_campaign=symbol; MP: ISL83490IBZ
USB1 = USB Micro-B: Value: Micro USB Type B; E14 pn: 2751675; mpn: 10118193-0001LF

## Nets that join several sheets
3.3V: Analog_Inputs (C85.2 C86.2 U14.2 U15.2), Colibri (12 pins), LoRa (C18.2 U4.5), Other (C20.2 U5.5), PowerSupply (8 pins), SDCard (8 pins), Serial (C25.2 C79.2), SPI (9 pins), USB (R49.2 R50.2 R61.2), Zigbee (5 pins), Ethernet (L19.1 X15.9 X15.12), RTC (10 pins), DebugConsole (5 pins)
5V: Other (C19.2 U5.3), PowerSupply (7 pins), SPI (P2.2 P2.4), USB (IC1.2)
CHASSIS_GND: Colibri (SW1.5), PowerSupply (8 pins), Ethernet (5 pins)
GND: Analog_Inputs (12 pins), Colibri (15 pins), L506 (62 pins), LoRa (C18.1 U4.2 U4.9 U4.16), Other (C19.1 C20.1 U5.2), PowerSupply (38 pins), SDCard (5 pins), Serial (U6.8 U6.15 U12.8 U12.15), SPI (21 pins), USB (16 pins), Zigbee (10 pins), Ethernet (9 pins), RTC (7 pins), DebugConsole (11 pins)
PWR_IN: L506 (F2.1), PowerSupply (C60.2 F1.1 X6.1 X17.2)
VCC_USB2: L506 (U9.11), USB (6 pins)
6ULL_PWM_E: Colibri (R10.2), Serial (U6.10)
6ULL_SPI2_CLK/8X_UARTB_RX: Serial (U12.5), SPI (U8.13 X2.36)
6ULL_SPI2_CS0/8X_UARTB_TX: Serial (U12.2), SPI (U8.10 X2.38)
6ULL_SPI2_MISO/8X_UARTB_RTS: Serial (U12.11), SPI (U8.3 X2.34)
8X_PWM_J: Other (X2.138), Serial (U6.11)
8X_SPI2_CLK: Serial (X2.96), SPI (U8.14)
8X_UARTB_CTS: Colibri (X2.32), Serial (U12.14)
8X_UARTD_RXD: Colibri (X2.30), Serial (U6.5)
8X_UARTD_TXD: Colibri (X2.28), Serial (U6.2)
ADC_GPIO0: Other (X2.50), SPI (U7.21)
ADC_GPIO1: Other (X2.52), SPI (U7.16)
ADC_REF1P: Analog_Inputs (R69.2 R71.1), SPI (U7.27)
AIN6: Analog_Inputs (U14.1 U14.4), SPI (R15.1)
AIN7: Analog_Inputs (U15.1 U15.4), SPI (R16.1)
AIN8: Analog_Inputs (R70.3), SPI (R17.1)
AIN9: Analog_Inputs (R70.2 R72.2), SPI (R18.1 U7.25)
CAN1_STB: Colibri (X2.158), Other (U5.8), Zigbee (P4.9)
CANH: Other (U5.7), Zigbee (P3.5)
CANL: Other (U5.6), Zigbee (P3.6)
GW_PWM_0: Colibri (R7.2), Zigbee (P4.2)
GW_PWM_1: Colibri (R2.2), Zigbee (P4.3)
GW_PWM_2: Serial (U6.9), Zigbee (P4.4)
GW_PWM_3: Colibri (R79.2), Zigbee (P4.5)
I2C_SCL: SPI (P2.5), RTC (IC2.1 R64.1 R88.2 U11.6)
I2C_SDA: SPI (P2.3), RTC (IC2.8 R63.1 R89.2 U11.5)
LORA_CS: LoRa (U4.13), SPI (U8.9)
LORA_DIO0: Colibri (X2.27), LoRa (U4.6)
LORA_DIO1: Colibri (X2.69), LoRa (U4.7)
LORA_DIO2: LoRa (U4.8), Other (X2.71)
LORA_DIO3: Colibri (X2.77), LoRa (U4.3)
LORA_DIO4: Colibri (X2.98), LoRa (U4.4)
LORA_DIO5: Colibri (X2.99), LoRa (U4.15)
LORA_MISO: LoRa (U4.10), SPI (U8.4)
LORA_MOSI: LoRa (U4.11), SPI (U8.7)
LORA_SCK: LoRa (U4.12), SPI (U8.12)
LTE_PWRKEY: L506 (C31.2 D2.2 U9.3), Other (X2.54)
LTE_RESET: L506 (C33.2 D3.2 U9.4), Other (X2.58)
MUX_SEL: Colibri (X2.104), Serial (U6.1 U12.1), SPI (U8.1)
PWR_EN: Colibri (X2.2), PowerSupply (R34.1 R37.1 R54.1)
RPI_GPIO04: Colibri (X2.23), SPI (P2.7)
RPI_GPIO05: Colibri (X2.6), SPI (P2.29)
RPI_GPIO06: Other (X2.62), SPI (P2.31)
RPI_GPIO12: Colibri (X2.85), SPI (P2.32)
RPI_GPIO13: Colibri (X2.65), SPI (P2.33)
RPI_GPIO16: Other (X2.64), SPI (P2.36)
RPI_GPIO18: Other (X2.48), SPI (P2.12), Zigbee (P4.8)
RPI_GPIO19: Other (X2.78), SPI (P2.35)
RPI_GPIO20: L506 (U9.49), Other (X2.66), SPI (P2.38)
RPI_GPIO21: Colibri (X2.8), L506 (U9.50), SPI (P2.40)
RPI_GPIO22: Other (X2.60), SPI (P2.15), Zigbee (P4.7)
RPI_GPIO23: Colibri (X2.95), SPI (P2.16)
RPI_GPIO26: L506 (U9.52), Other (X2.76), SPI (P2.37)
RPI_GPIO27: Colibri (X2.31), SPI (P2.13), Zigbee (P4.6)
RPI_LCD_RS: Colibri (X2.107), SPI (P2.18)
RPI_RST: Colibri (X2.106), SPI (P2.22)
RPI_TP_IRQ: Colibri (X2.45), SPI (P2.11)
RPI_URXD: Serial (U6.7), SPI (P2.10)
RPI_UTXD: Serial (U6.4), SPI (P2.8)
RS485_RX_N: Zigbee (P3.3), DebugConsole (R5.2 U13.8)
RS485_RX_P: Zigbee (P3.4), DebugConsole (R5.1 U13.7)
RS485_TX_N: Zigbee (P3.1), DebugConsole (U13.6)
RS485_TX_P: Zigbee (P3.2), DebugConsole (U13.5)
RTC_MFP_IO: Colibri (X2.100), RTC (R65.1 U11.3)
RTD_WIRE0: Analog_Inputs (P1.1), SPI (R11.1)
RTD_WIRE1: Analog_Inputs (P1.2), SPI (R12.1)
RTD_WIRE2: Analog_Inputs (P1.3), SPI (R67.1 R68.1)
TC_WIRE0: Analog_Inputs (P1.5), SPI (R13.1)
TC_WIRE1: Analog_Inputs (P1.6), SPI (R14.1)
UART_A_RXD: Serial (X2.33), DebugConsole (U3.26)
UART_A_TXD: Serial (X2.35), DebugConsole (U3.25)
UART_C_RXD: Serial (X2.19), DebugConsole (U13.2)
UART_C_TXD: Serial (X2.21), DebugConsole (U13.3)
USB_HOST_N: L506 (U9.12), USB (D5.3 L16.2 R30.2)
USB_HOST_P: L506 (U9.13), USB (D5.4 L16.3 R59.2)
ZBEE_232_CTS: Serial (U12.12), Zigbee (CR1.12 U2.12)
ZBEE_232_RTS: Serial (U12.9), Zigbee (CR1.11 U2.16)
ZBEE_232_RXD: Serial (U12.7), Zigbee (CR1.9 U2.2)
ZBEE_232_TXD: Serial (U12.4), Zigbee (CR1.10 U2.3)
ZBEE_ASSOC: Colibri (X2.73), Zigbee (U2.15)
ZBEE_RST: Colibri (X2.105), Zigbee (U2.5)
ZBEE_SLP_REQ: Other (X2.70), Zigbee (U2.9)
ZBEE_STATUS: Other (X2.74), Zigbee (U2.13)